# Altium schematic sheet Senso_part.SchDoc
size A; SheetNumber: 1; SheetTotal: 1
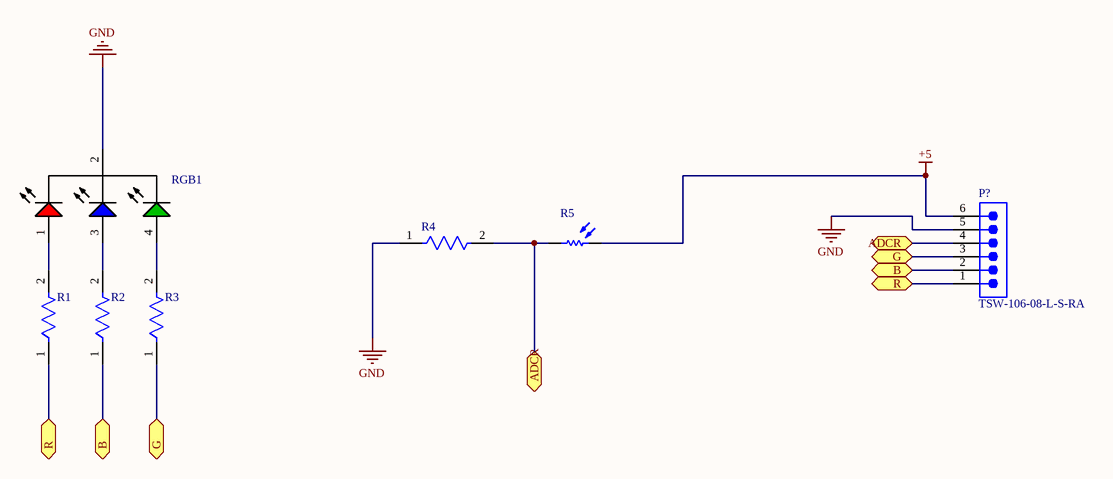
[diagram p0: Senso_part.SchDoc]

## Parts
P?  TSW-106-08-L-S-RA  [SMTC-TSW-106-08-X-S-RA]
R1  RNC55H1002FSB14  [FP-RNC55-MFG]  (value not drawn)
R2  RNC55H1002FSB14  [FP-RNC55-MFG]  (value not drawn)
R3  RNC55H1002FSB14  [FP-RNC55-MFG]  (value not drawn)
R4  RNC55H1002FSB14  [FP-RNC55-MFG]  (value not drawn)
R5  VT90N1  [EXCE-VT90N1]  (value not drawn)
RGB1  WP154A4SUREQBFZGC  [KING-WP154A4SUREQBFZGC_V]  (value not drawn)

## Ports
ADCR (bidir), B (bidir), G (bidir), R (bidir)

## Nets
+5: P?.6 R5.2
GND: P?.5 R4.1 RGB1.2(CATHODE)
ADCR: P?.4 R4.2 R5.1 ; port ADCR
B: P?.2 R2.1 ; port B
G: P?.3 R3.1 ; port G
R: P?.1 R1.1 ; port R
NetR1_2: R1.2 RGB1.1(RED)
NetR2_2: R2.2 RGB1.3(BLUE)
NetR3_2: R3.2 RGB1.4(GREEN)

## Library data of the parts
P? = CMP-1024-00390-1: 0.025" SQ Post Header, Through-hole, Right Angle, -55 to 125 degC, 2.54 mm Pitch, 6-Pin, Male, RoHS; Manufacturer: Samtec; Pitch: 2.54 mm; ComponentLink2URL: http://www.samtec.com/documents/webfiles/pdf/TSW_TH.PDF; ComponentLink3Description: Package Specification; PackageVersion: DM, 8/1988; ComponentLink3URL: http://www.samtec.com/documents/webfiles/cpdf/TSW-XXX-XX-XXX-X-XX-XXX-MKT.pdf; ComponentLink1Description: Manufacturer URL; RoHS: True; ComponentLink2Description: Datasheet; PackageDescription: .025[0.64] SQ. Post Terminal Strip Assembly; Temperature Range: -55 to 125 degC; Orientation: Right Angle; DatasheetVersion: F-214; PartNumber: TSW-106-08-L-S-RA; PackageReference: TSW-106-08-X-S-RA; ComponentLink1URL: http://www.samtec.com; Mounting Technology: Through-hole
R1-R4 = CMP-02408-000004-1: RES 10K OHM 1/8W 1% AXIAL; Manufacturer: Vishay; Voltage Rating: 200V; Power Rating: 0.125W; Resistance: 10kΩ; Description: 10 kOhms ±1% 0.125W, 1/8W Through Hole Resistor Axial Military, Moisture Resistant, Weldable Metal Film; Temperature Coefficient: 50ppm/°C; Value: 10kΩ; Automotive: No; Category: Res; Tolerance: 1%; Temperature: -65°C to +175°C; Device Class L2: Resistors; Composition: Metal Film; Height: 2.69mm; Failure Rate: 0.001%; ComponentLink2URL: https://www.vishay.com/docs/31025/erc.pdf; Manufacturer Part Number: RNC55H1002FSB14; Temperature Range High: +175°C; Lead Free: No; Series: RNC; Device Class L1: Passive Components; Ipc Land Pattern Name: RESAD1100W85L762D269; Octopart: https://octopart.com/rnc55h1002fs-vishay-40848808; Package: RNC55; RoHS: FALSE; Military Standard: true; Device Class L3: Through-Hole Resistors; ComponentLink2Description: Datasheet; Digikey Description: RES 10K OHM 1/8W 1% AXIAL; Temperature Range Low: -65°C
R5 = CMP-2000-07406-1: Photoconductive Resistor, 200 kOhm, 100 V, 80 mW, -40 to 75 degC, 2-Pin THD, RoHS; Manufacturer: Excelitas Technology; SVHC: Cadmiumchloride(15-Jun-2015); Power Rating: 80mW; Resistance @ Lux: 12kohm; Voltage Rating: 100V; Product Range: -; Datasheet Version: 09/2006; Resistor Case Style: -; Operating Temperature Max: 75°C; Package Reference: VT90N1; Datasheet URL: http://datasheet.octopart.com/VT90N1-Excelitas-datasheet-10388451.pdf; Mounting Technology: ThroughHole; Operating Temperature Min: -40°C; Dark Resistance: 200kohm; Package Description: 2-Pin Through Hole Device, Body Width 4.17 mm (Max), Height 2.29 mm; Manufacturer URL: http://www.excelitas.com/Pages/Index.aspx; Packaging: Each
RGB1 = CMP-2000-07415-1: Full Color LED Lamp, Dominant Wavelength RGB 630 / 525 / 465 nm, -40 to 85 degC, 4-Pin THD, RoHS; Manufacturer: Kingbright; Viewing Angle: 50°; Wavelength - Dominant: 630nm,525nm,465nm; Online Catalog: 5mm,T-13/4(RGB)RoundwithDomedTopLEDLamp; Millicandela Rating: 1300mcdRed,1700mcdGreen,900mcdBlue; Other Names: 754-1615 / WP154A4SUREQBFZGC-ND; Current - Test: 20mA; Wavelength - Peak: 645nm,515nm,460nm; Voltage - Forward (Vf) (Typ): 1.9VRed,3.3VGreen,3.3VBlue; Lens Type: Clear; 3D Model: WP154A4SUREQBFZGW.sldprt / WP154A4SUREQBFZGW.pro / WP154A4SUREQBFZGW.igs / WP154A4SUREQBFZGW.stp; Lens Style/Size: RoundwithDomedTop,5mm,T-13/4; Packaging: Bulk; Datasheet URL: https://www.kingbrightusa.com/images/catalog/spec/WP154A4SUREQBFZGC.pdf; Family: LEDIndication-Discrete; Color: Red,Green,Blue(RGB); Datasheet Version: Rev. 5A, 08/2014; Category: Optoelectronics; Manufacturer URL: http://www.kingbright.com/; Height: 8.60mm; Mounting Type: ThroughHole; Package Reference: WP154A4SUREQBFZGC; Mounting Technology: ThroughHole; Package Description: 4-Pin Through Hole LED, Dia 5.9 mm, Pitch 1.27 mm; Standard Package: 500; Package / Case: Radial-4Leads